# Altium schematic sheet Connecors.SchDoc: =ProjectDescription
size 420 x 297 mm; Address1: Address1; Address2: Address2; Address3: Address3; Address4: Address4; SheetNumber: 1; SheetTotal: 2; Scale: 1:1; DocumentType: Схема электрическая принципиальная
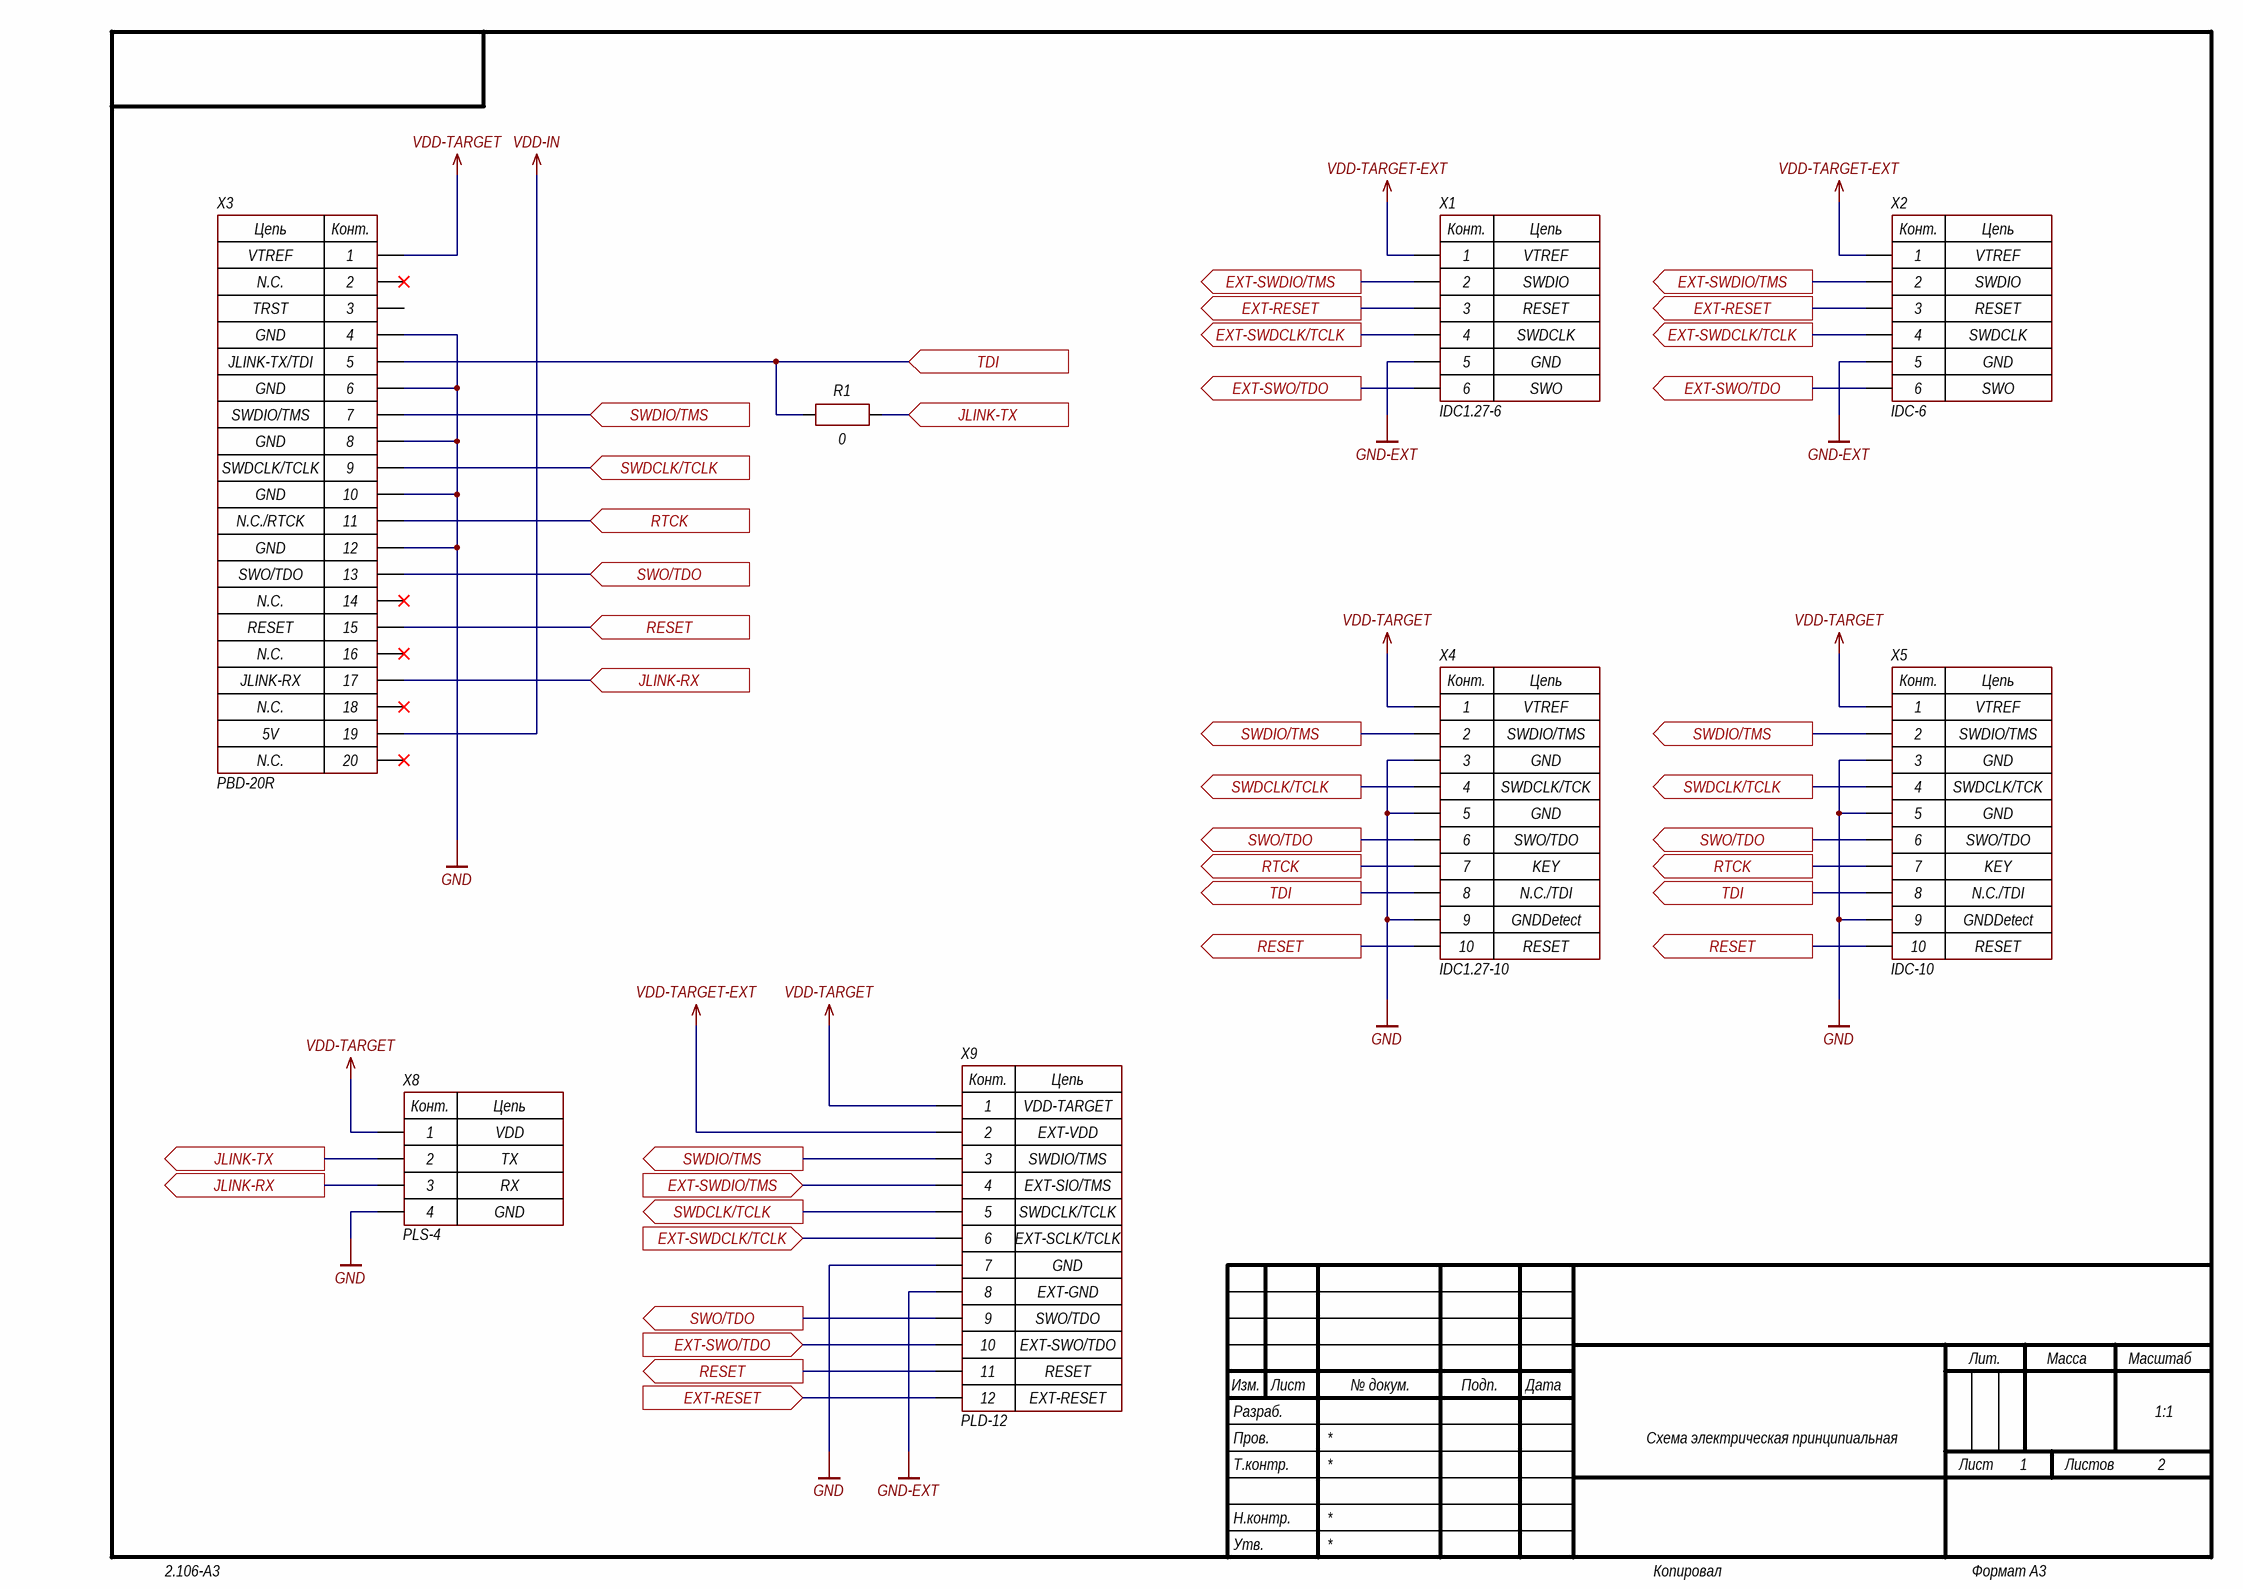
[diagram p0: Connecors.SchDoc]

## Parts
R1  0  [CH0402R]
X1  IDC1.27-6  [CON: IDC1.27-6]
X2  IDC-6  [CON: IDC-6MS]
X3  PBD-20R  [CON: PBD-20R]
X4  IDC1.27-10  [CON: IDC1.27-10]
X5  IDC-10  [CON: IDC-10MS]
X8  PLS-4  [CON: PLS-4]
X9  PLD-12  [CON: PLD-12]

## Ports
EXT-RESET (in), EXT-RESET (out), EXT-SWDCLK/TCLK (in), EXT-SWDCLK/TCLK (out), EXT-SWDIO/TMS (in), EXT-SWDIO/TMS (out), EXT-SWO/TDO (in), EXT-SWO/TDO (out), JLINK-RX (in), JLINK-RX (out), JLINK-TX (in), JLINK-TX (out), RESET (in), RESET (out), RTCK (in), RTCK (out), SWDCLK/TCLK (in), SWDCLK/TCLK (out), SWDIO/TMS (in), SWDIO/TMS (out), SWO/TDO (in), SWO/TDO (out), TDI (in), TDI (out)

## Nets
GND: X3.4 X3.6 X3.8 X3.10 X3.12 X4.3 X4.5 X4.9 X5.3 X5.5 X5.9 X8.4 X9.7
GND-EXT: X1.5 X2.5 X9.8
VDD-IN: X3.19
VDD-TARGET: X3.1 X4.1 X5.1 X8.1 X9.1
VDD-TARGET-EXT: X1.1 X2.1 X9.2
EXT-RESET: X1.3 X2.3 X9.12 ; port EXT-RESET
EXT-SWDCLK/TCLK: X1.4 X2.4 X9.6 ; port EXT-SWDCLK/TCLK
EXT-SWDIO/TMS: X1.2 X2.2 X9.4 ; port EXT-SWDIO/TMS
EXT-SWO/TDO: X1.6 X2.6 X9.10 ; port EXT-SWO/TDO
JLINK-RX: X3.17 X8.3 ; port JLINK-RX
JLINK-TX: R1.2 X8.2 ; port JLINK-TX
RESET: X3.15 X4.10 X5.10 X9.11 ; port RESET
RTCK: X3.11 X4.7 X5.7 ; port RTCK
SWDCLK/TCLK: X3.9 X4.4 X5.4 X9.5 ; port SWDCLK/TCLK
SWDIO/TMS: X3.7 X4.2 X5.2 X9.3 ; port SWDIO/TMS
SWO/TDO: X3.13 X4.6 X5.6 X9.9 ; port SWO/TDO
TDI: R1.1 X3.5 X4.8 X5.8 ; port TDI

Not connected (* = marked no-connect by the designer): X3 2* 3 14* 16* 18* 20*

## Notes on the sheet
- VTREF
- N.C.
- TRST
- GND
- SWDIO
- SWDCLK
- RESET
- JLINK-TX/TDI
- SWO
- SWDIO/TMS
- SWDCLK/TCLK
- N.C./RTCK
- SWO/TDO
- 5V
- JLINK-RX
- SWDCLK/TCK
- KEY
- GNDDetect
- N.C./TDI
- VDD
- EXT-VDD
- VDD-TARGET
- TX
- RX
- EXT-SIO/TMS
- (near X9) EXT-SCLK/TCLK
- EXT-SWO/TDO
- EXT-GND
- EXT-RESET
- Разраб.
- Изм.
- Лист
- № докум.
- Подп.
- Дата
- Лит.
- Масса
- Масштаб
- Пров.
- Т.контр.
- Листов
- Утв.
- Н.контр.
- 2.106-A3
- Копировал
- Формат А3
- (in symbol 4-Connector) Конт.; Цепь
- (in symbol 6-Connector) Конт.; Цепь
- (in symbol 10-Connector) Конт.; Цепь
- (in symbol 12-Connector) Конт.; Цепь
- (in symbol 20-Connector) Цепь; Конт.

## Library data of the parts
R1 = Resistor: Manufacturer: *; Model: *; HelpURL: *; ComponentKind: *; Value: 0; ClassName: JLINK-CONNECTOR
X1 X2 = 6-Connector: Manufacturer: *; HelpURL: *; ComponentKind: *; ClassName: *
  X1: Model: IDC1.27-6
  X2: Model: IDC-6
X3 = 20-Connector: Model: PBD-20R; Manufacturer: *; HelpURL: *; ComponentKind: *; ClassName: JLINK-CONNECTOR
X4 X5 = 10-Connector: Manufacturer: *; HelpURL: *; ComponentKind: *; ClassName: *
  X4: Model: IDC1.27-10
  X5: Model: IDC-10
X8 = 4-Connector: Model: PLS-4; Manufacturer: *; HelpURL: *; ComponentKind: *; ClassName: *
X9 = 12-Connector: Model: PLD-12; Manufacturer: *; HelpURL: *; ComponentKind: *